# Altium schematic sheet [1] LDD-1200.SchDoc
size A3; DocumentNumber: 5; SheetNumber: 5; SheetTotal: 10
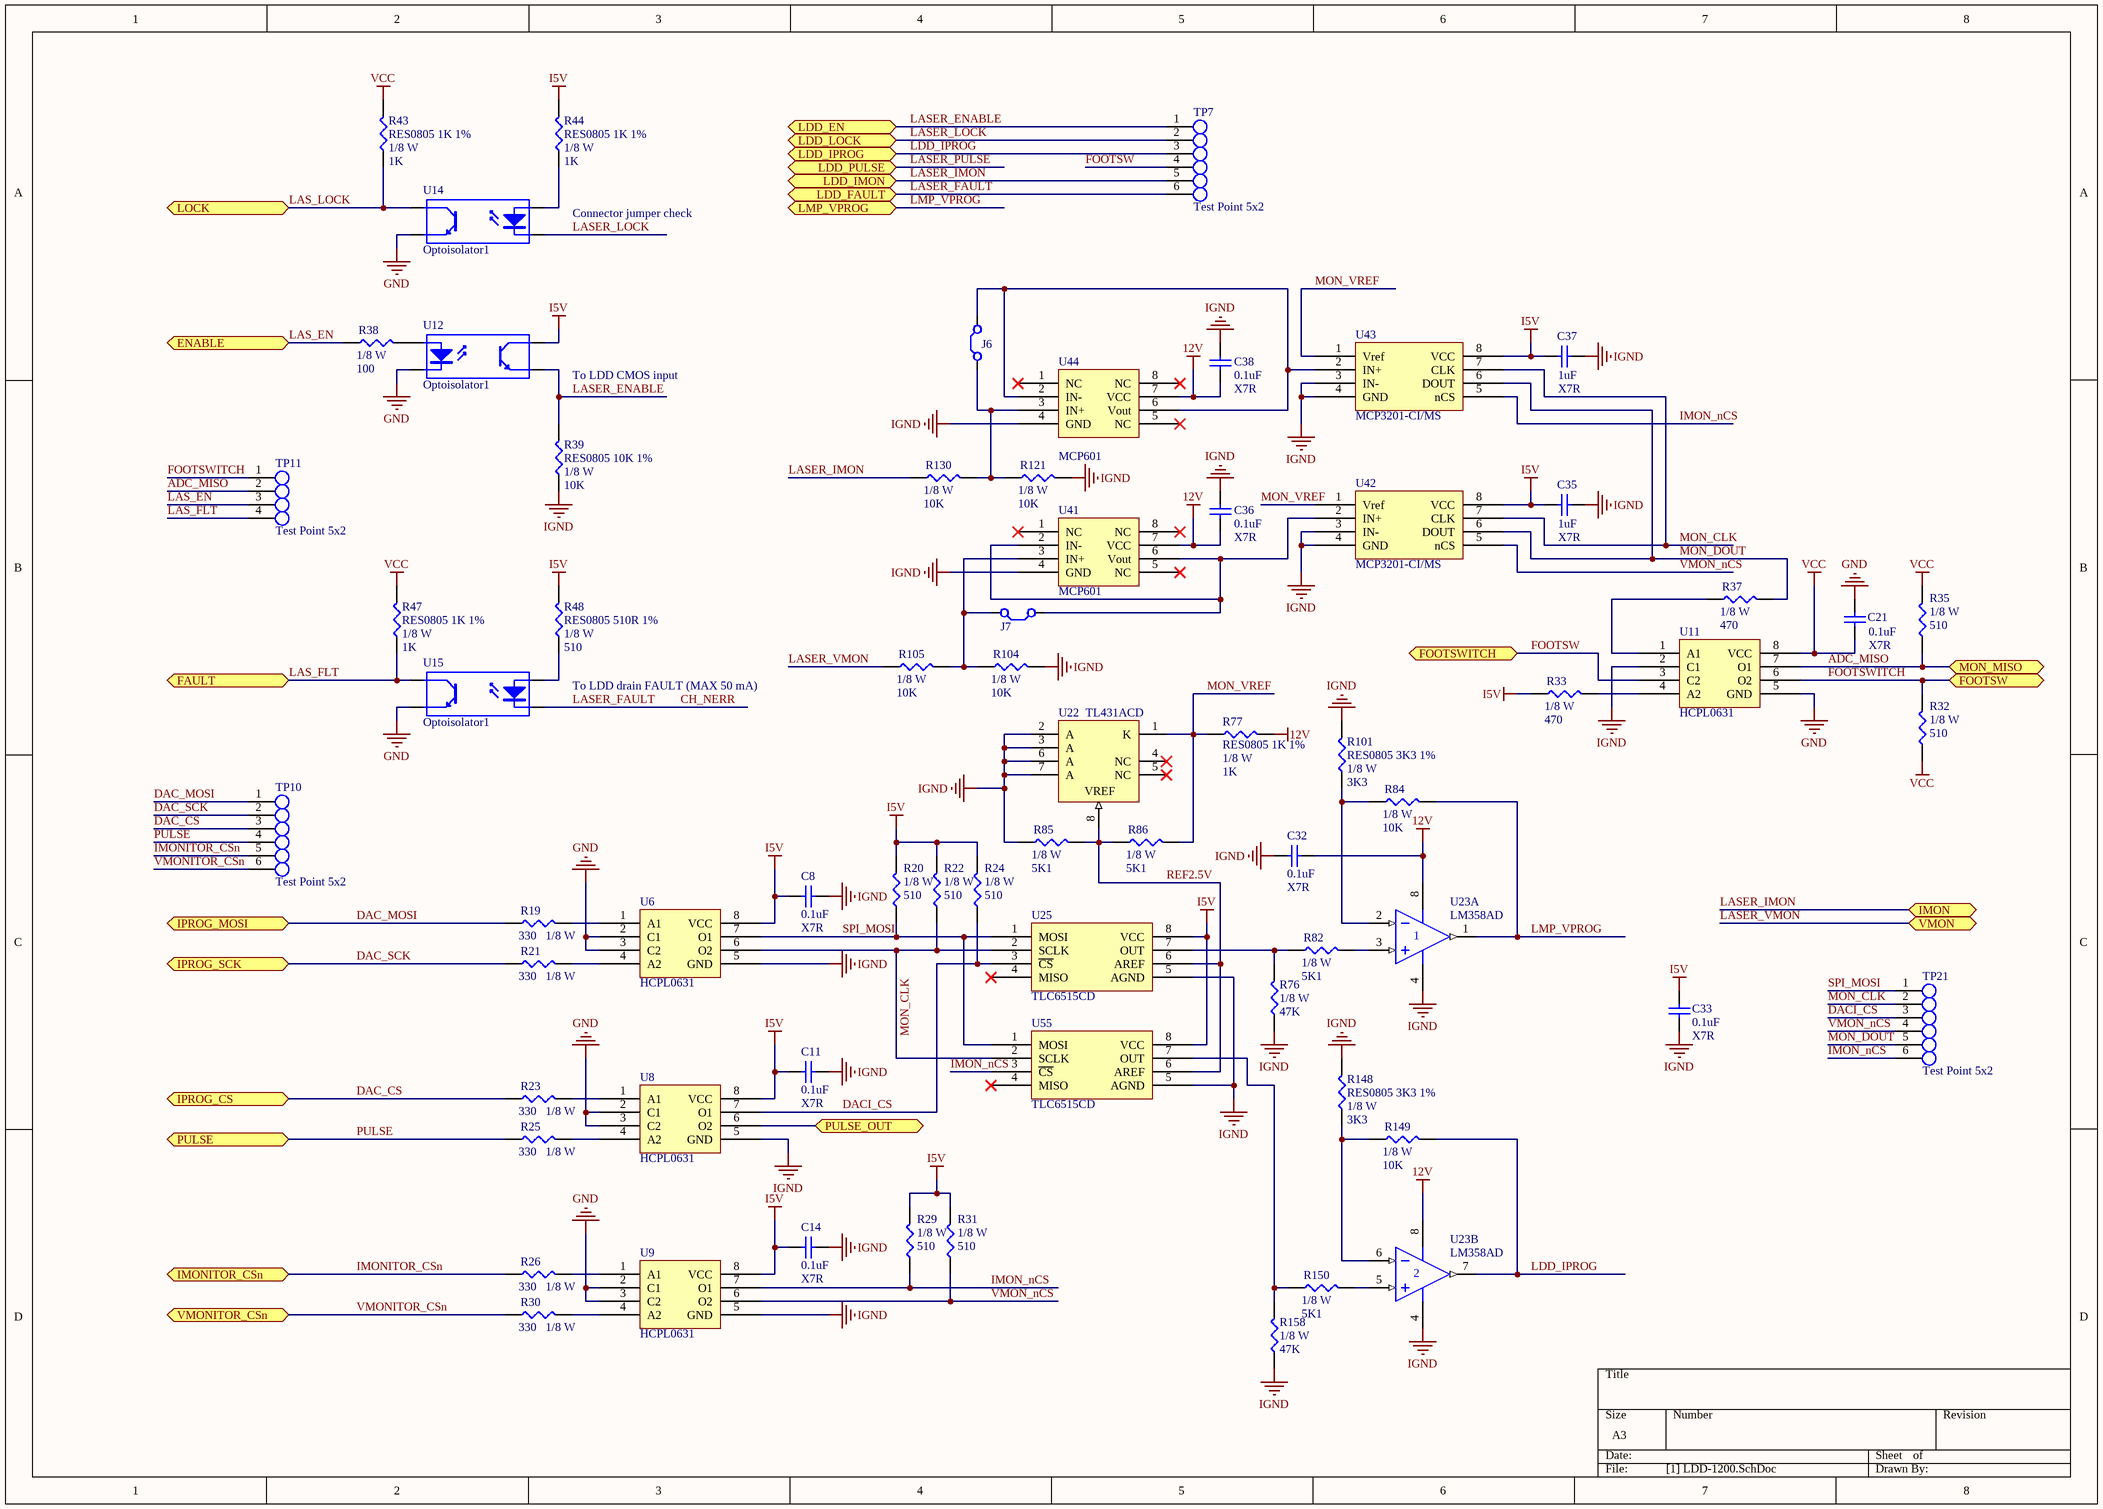
[diagram p0: [1] LDD-1200.SchDoc]

## Parts
C8  value 0.1uF  Type: X7R  [CAP0805]  (hidden comment: CAP0805 0.1uF X7R)
C11  value 0.1uF  Type: X7R  [CAP0805]  (hidden comment: CAP0805 0.1uF X7R)
C14  value 0.1uF  Type: X7R  [CAP0805]  (hidden comment: CAP0805 0.1uF X7R)
C21  value 0.1uF  Type: X7R  [CAP0805]  (hidden comment: CAP0805 0.1uF X7R)
C32  value 0.1uF  Type: X7R  [CAP0805]  (hidden comment: CAP0805 0.1uF X7R)
C33  value 0.1uF  Type: X7R  [CAP0805]  (hidden comment: CAP0805 0.1uF X7R)
C35  value 1uF  Type: X7R  [CAP0805]  (hidden comment: CAP0805 1uF X7R)
C36  value 0.1uF  Type: X7R  [CAP0805]  (hidden comment: CAP0805 0.1uF X7R)
C37  value 1uF  Type: X7R  [CAP0805]  (hidden comment: CAP0805 1uF X7R)
C38  value 0.1uF  Type: X7R  [CAP0805]  (hidden comment: CAP0805 0.1uF X7R)
J6  Jumper  (value not drawn)  (net tie, no BOM)
J7  Jumper  (value not drawn)  (net tie, no BOM)
R19  value 330  Rating: 1/8 W  [RES0805]  (hidden comment: RES0805 330R 1%)
R20  value 510  Rating: 1/8 W  [RES0805]  (hidden comment: RES0805 510R 1%)
R21  value 330  Rating: 1/8 W  [RES0805]  (hidden comment: RES0805 330R 1%)
R22  value 510  Rating: 1/8 W  [RES0805]  (hidden comment: RES0805 510R 1%)
R23  value 330  Rating: 1/8 W  [RES0805]  (hidden comment: RES0805 330R 1%)
R24  value 510  Rating: 1/8 W  [RES0805]  (hidden comment: RES0805 510R 1%)
R25  value 330  Rating: 1/8 W  [RES0805]  (hidden comment: RES0805 330R 1%)
R26  value 330  Rating: 1/8 W  [RES0805]  (hidden comment: RES0805 330R 1%)
R29  value 510  Rating: 1/8 W  [RES0805]  (hidden comment: RES0805 510R 1%)
R30  value 330  Rating: 1/8 W  [RES0805]  (hidden comment: RES0805 330R 1%)
R31  value 510  Rating: 1/8 W  [RES0805]  (hidden comment: RES0805 510R 1%)
R32  value 510  Rating: 1/8 W  [RES0805]  (hidden comment: RES0805 510R 1%)
R33  value 470  Rating: 1/8 W  [RES0805]  (hidden comment: RES0805 470R 1%)
R35  value 510  Rating: 1/8 W  [RES0805]  (hidden comment: RES0805 510R 1%)
R37  value 470  Rating: 1/8 W  [RES0805]  (hidden comment: RES0805 470R 1%)
R38  value 100  Rating: 1/8 W  [RES0805]  (hidden comment: RES0805 100R 1%)
R39  RES0805 10K 1%  value 10K  Rating: 1/8 W  [RES0805]
R43  RES0805 1K 1%  value 1K  Rating: 1/8 W  [RES0805]
R44  RES0805 1K 1%  value 1K  Rating: 1/8 W  [RES0805]
R47  RES0805 1K 1%  value 1K  Rating: 1/8 W  [RES0805]
R48  RES0805 510R 1%  value 510  Rating: 1/8 W  [RES0805]
R76  value 47K  Rating: 1/8 W  [RES0805]  (hidden comment: RES0805 47K 1%)
R77  RES0805 1K 1%  value 1K  Rating: 1/8 W  [RES0805]
R82  value 5K1  Rating: 1/8 W  [RES0805]  (hidden comment: RES0805 5K1 1%)
R84  value 10K  Rating: 1/8 W  [RES0805]  (hidden comment: RES0805 10K 1%)
R85  value 5K1  Rating: 1/8 W  [RES0805]  (hidden comment: RES0805 5K1 1%)
R86  value 5K1  Rating: 1/8 W  [RES0805]  (hidden comment: RES0805 5K1 1%)
R101  RES0805 3K3 1%  value 3K3  Rating: 1/8 W  [RES0805]
R104  value 10K  Rating: 1/8 W  [RES0805]  (hidden comment: RES0805 10K 1%)
R105  value 10K  Rating: 1/8 W  [RES0805]  (hidden comment: RES0805 10K 1%)
R121  value 10K  Rating: 1/8 W  [RES0805]  (hidden comment: RES0805 10K 1%)
R130  value 10K  Rating: 1/8 W  [RES0805]  (hidden comment: RES0805 10K 1%)
R148  RES0805 3K3 1%  value 3K3  Rating: 1/8 W  [RES0805]
R149  value 10K  Rating: 1/8 W  [RES0805]  (hidden comment: RES0805 10K 1%)
R150  value 5K1  Rating: 1/8 W  [RES0805]  (hidden comment: RES0805 5K1 1%)
R158  value 47K  Rating: 1/8 W  [RES0805]  (hidden comment: RES0805 47K 1%)
TP7  Test Point 5x2  [PG-1.5-13.5-6P-2.54PH]
TP10  Test Point 5x2  [PG-1.5-13.5-6P-2.54PH]
TP11  Test Point 5x2  [PG-1.5-13.5-4P-2.54PH]
TP21  Test Point 5x2  [PG-1.5-13.5-6P-2.54PH]
U6  HCPL0631  [SOIC8]
U8  HCPL0631  [SOIC8]
U9  HCPL0631  [SOIC8]
U11  HCPL0631  [SOIC8]
U12  Optoisolator1  [DIP-4]
U14  Optoisolator1  [DIP-4]
U15  Optoisolator1  [DIP-4]
U22  TL431ACD  [SOIC8]
U23  LM358AD  [SOIC8]  (parts A,B of 2)
U25  TLC6515CD  [SOIC8]
U41  MCP601  [SOIC8]
U42  MCP3201-CI/MS  [MSOP8]
U43  MCP3201-CI/MS  [MSOP8]
U44  MCP601  [SOIC8]
U55  TLC6515CD  [SOIC8]

## Ports
ENABLE, FAULT, FOOTSW, FOOTSWITCH, IMON, IMONITOR_CSn, IPROG_CS, IPROG_MOSI, IPROG_SCK, LDD_EN, LDD_FAULT, LDD_IMON, LDD_IPROG, LDD_LOCK, LDD_PULSE, LMP_VPROG, LOCK, MON_MISO, PULSE, PULSE_OUT, VMON, VMONITOR_CSn

## Nets
12V: C32.2 C36.1 C38.1 R77.2 U23.8(V+) U41.7(VCC) U44.7(VCC)
GND: C21.2 U6.2(C1) U6.3(C2) U8.2(C1) U8.3(C2) U9.2(C1) U9.3(C2) U11.5(GND) U12.2(K) U14.3(E) U15.3(E)
I5V: C8.1 C11.1 C14.1 C33.1 C35.1 C37.1 R20.2 R22.2 R24.2 R29.2 R31.2 R33.1 R44.2 R48.2 U6.8(VCC) U8.8(VCC) U9.8(VCC) U12.4(C) U25.8(VCC) U42.8(VCC) U43.8(VCC) U55.8(VCC)
IGND: C8.2 C11.2 C14.2 C32.1 C33.2 C35.2 C36.2 C37.2 C38.2 R39.1 R76.1 R85.1 R101.2 R104.2 R121.2 R148.2 R158.1 U6.5(GND) U8.5(GND) U9.5(GND) U11.2(C1) U22.2(A) U22.3(A) U22.6(A) U22.7(A) U23.4(V-) U25.5(AGND) U41.4(GND) U42.3(IN-) U42.4(GND) U43.3(IN-) U43.4(GND) U44.4(GND) U55.5(AGND)
VCC: C21.1 R32.1 R35.2 R43.2 R47.2 U11.8(VCC)
ADC_MISO: R35.1 TP11.2 U11.7(O1) ; port MON_MISO
CH_NERR: TP7.6 U15.2(K) ; port LDD_FAULT  [also labelled LASER_FAULT]
DAC_CS: R23.1 TP10.3 ; port IPROG_CS
DAC_MOSI: R19.1 TP10.1 ; port IPROG_MOSI
DAC_SCK: R21.1 TP10.2 ; port IPROG_SCK
DACI_CS: R24.1 TP21.3 U8.7(O1) U25.3(~{CS})
FOOTSW: TP7.4 U11.3(C2) ; port FOOTSWITCH
FOOTSWITCH: R32.2 TP11.1 U11.6(O2) ; port FOOTSW
IMON_nCS: R29.1 TP21.6 U9.7(O1) U43.5(nCS) U55.3(~{CS})
IMONITOR_CSn: R26.1 TP10.5 ; port IMONITOR_CSn
LAS_EN: R38.1 TP11.3 ; port ENABLE
LAS_FLT: R47.1 TP11.4 U15.4(C) ; port FAULT
LAS_LOCK: R43.1 U14.4(C) ; port LOCK
LASER_ENABLE: R39.2 TP7.1 U12.3(E) ; port LDD_EN
LASER_IMON: R130.1 TP7.5 ; port LDD_IMON, port IMON
LASER_LOCK: TP7.2 U14.2(K) ; port LDD_LOCK
LASER_PULSE: port LDD_PULSE
LASER_VMON: R105.1 ; port VMON
LDD_IPROG: R149.2 TP7.3 U23.7(OUT) ; port LDD_IPROG
LMP_VPROG: R84.2 U23.1(OUT) ; port LMP_VPROG
MON_CLK: R22.1 TP21.2 U6.6(O2) U25.2(SCLK) U42.7(CLK) U43.7(CLK) U55.2(SCLK)
MON_DOUT: R37.2 TP21.5 U42.6(DOUT) U43.6(DOUT)
MON_VREF: R77.1 R86.2 U22.1(K) U42.1(Vref) U43.1(Vref)
PULSE: R25.1 TP10.4 ; port PULSE
PULSE_OUT: U8.6(O2) ; port PULSE_OUT
REF2.5V: R85.2 R86.1 U22.8(VREF) U25.6(AREF) U55.6(AREF)
SPI_MOSI: R20.1 TP21.1 U6.7(O1) U25.1(MOSI) U55.1(MOSI)
VMON_nCS: R31.1 TP21.4 U9.6(O2) U42.5(nCS)
VMONITOR_CSn: R30.1 TP10.6 ; port VMONITOR_CSn
NetJ6_0: J6.0 R121.1 R130.2 U44.3(IN+)
NetJ6_1: J6.1 U43.2(IN+) U44.2(IN-) U44.6(Vout)
NetJ7_0: J7.0 U41.2(IN-) U41.6(Vout) U42.2(IN+)
NetJ7_1: J7.1 R104.1 R105.2 U41.3(IN+)
NetR19_2: R19.2 U6.1(A1)
NetR21_2: R21.2 U6.4(A2)
NetR23_2: R23.2 U8.1(A1)
NetR25_2: R25.2 U8.4(A2)
NetR26_2: R26.2 U9.1(A1)
NetR30_2: R30.2 U9.4(A2)
NetR33_2: R33.2 U11.4(A2)
NetR37_1: R37.1 U11.1(A1)
NetR38_2: R38.2 U12.1(A)
NetR44_1: R44.1 U14.1(A)
NetR48_1: R48.1 U15.1(A)
NetR76_2: R76.2 R82.1 U25.7(OUT)
NetR82_2: R82.2 U23.3(IN+)
NetR84_1: R84.1 R101.1 U23.2(IN-)
NetR148_1: R148.1 R149.1 U23.6(IN-)
NetR150_1: R150.1 R158.2 U55.7(OUT)
NetR150_2: R150.2 U23.5(IN+)

Not connected (* = marked no-connect by the designer): U22 4(NC)* 5(NC)*; U25 4(MISO)*; U41 1(NC)* 5(NC)* 8(NC)*; U44 1(NC)* 5(NC)* 8(NC)*; U55 4(MISO)*

## Notes on the sheet
- Connector jumper check
- To LDD CMOS input
- To LDD drain FAULT (MAX 50 mA)

## Library data of the parts
C8 C11 C14 C21 C32 C33 C36 C38 = CAP0805 0.1uF X7R: Surface-mount ceramic multilayer capacitor; Manufacturer: YAGEO; Manufacturer Part Number: CC0805JRX7R9BB104; Voltage: 50V; Tolerance: 5%; ComponentLink1Description: Datasheet; ComponentLink1URL: http://www.deaha.com/pdf/YAGEO-CC_series.pdf
C35 C37 = CAP0805 1uF X7R: Surface-mount ceramic multilayer capacitor; Manufacturer: YAGEO; Manufacturer Part Number: CC0805KKX7R7BB105; Voltage: 16V; Tolerance: 5%; ComponentLink1Description: Datasheet; ComponentLink1URL: http://www.deaha.com/pdf/YAGEO-CC_series.pdf
R19 R21 R23 R25 R26 R30 = RES0805 330R 1%: Think Film Chip resistor; Manufacturer Part Number: RC0805FR-07330RL; Temperature Coefficient: 100ppm/K; Tolerance: 1%; Type: ThickFilm
R20 R22 R24 R29 R31 R32 R35 R48 = RES0805 510R 1%: Think Film Chip resistor; Manufacturer Part Number: RC0805FR-07510RL; Temperature Coefficient: 100ppm/K; Tolerance: 1%; Type: ThickFilm
R33 R37 = RES0805 470R 1%: Think Film Chip resistor; Manufacturer Part Number: RC0805JR-07470RL; Temperature Coefficient: 100ppm/K; Tolerance: 1%; Type: ThickFilm
R38 = RES0805 100R 1%: Think Film Chip resistor; Manufacturer Part Number: RC0805FR-07100RL; Temperature Coefficient: 100ppm/K; Tolerance: 1%; Type: ThickFilm
R39 R84 R104 R105 R121 R130 R149 = RES0805 10K 1%: Think Film Chip resistor; Manufacturer Part Number: RC0805FR-0710KL; Temperature Coefficient: 100ppm/K; Tolerance: 1%; Type: ThickFilm
R43 R44 R47 R77 = RES0805 1K 1%: Think Film Chip resistor; Manufacturer Part Number: RC0805FR-071KL; Temperature Coefficient: 100ppm/K; Tolerance: 1%; Type: ThickFilm
R76 R158 = RES0805 47K 1%: Think Film Chip resistor; Manufacturer Part Number: RC0805JR-0747KL; Temperature Coefficient: 100ppm/K; Tolerance: 1%; Type: ThickFilm
R82 R85 R86 R150 = RES0805 5K1 1%: Think Film Chip resistor; Manufacturer Part Number: RC0805FR-075K1L; Temperature Coefficient: 100ppm/K; Tolerance: 1%; Type: ThickFilm
R101 R148 = RES0805 3K3 1%: Think Film Chip resistor; Manufacturer Part Number: RC0805FR-073K3L; Temperature Coefficient: 100ppm/K; Tolerance: 1%; Type: ThickFilm
TP7 TP10 TP21 = PG-1.5-13.5-6P-2.54PH
TP11 = PG-1.5-13.5-4P-2.54PH
U6 U8 U9 U11 = HCPL0631: 2-channel opto-coupler
U12 U14 U15 = Optoisolator1: 4-Pin Phototransistor Optocoupler; Published: 24-Mar-1999; LatestRevisionDate: 04-Mar-2005; LatestRevisionNote: Sch pins 3 & 4 Swapped.; DatasheetVersion: Nov-2003; PackageReference: DIP-4; Publisher: Altium Limited
U22 = TL431ACD: Adjustable Precision Shunt Regulator; Published: 15-Apr-2002; LatestRevisionDate: 13-Apr-2006; LatestRevisionNote: IPC-7351 Footprint Added.; DatasheetVersion: Oct-2000; PackageVersion: Jan-1998; PackageReference: D008; Publisher: Altium Limited; PackageDescription: 8-Pin Small Outline Integrated Circuit 1.27 mm Pitch; Code_IPC: SOIC127P600-8; ComponentLink1Description: Manufacturer Link; ComponentLink1URL: http://www.ti.com/; ComponentLink2Description: Datasheet; ComponentLink2URL: http://www-s.ti.com/sc/ds/tl431a.pdf
U23 = LM358AD: Dual Operational Amplifier; Published: 15-Apr-2002; LatestRevisionDate: 13-Apr-2006; LatestRevisionNote: IPC-7351 Footprint Added.; DatasheetVersion: Aug-1988; PackageVersion: Jan-1998; PackageReference: D008; Publisher: Altium Limited; PackageDescription: 8-Pin Small Outline Integrated Circuit 1.27 mm Pitch; Code_IPC: SOIC127P600-8; ComponentLink1Description: Manufacturer Link; ComponentLink1URL: http://www.ti.com/; ComponentLink2Description: Datasheet; ComponentLink2URL: http://www-s.ti.com/sc/ds/lm358.pdf
U25 U55 = TLC6515: 10-bit analog to digiyal converter; Manufacturer: Texas Instruments
U41 U44 = MCP601: Operational Amplifier
U42 U43 = MCP3201-CI/MS: SAR 12-bit Analog-to-Digital  (A/D); Manufacturer: Microchip; Maximum Sampling Rate: 100 ksps; Supplier 1: Platan; Supplier 2: Terraelectronica; ComponentLink1Description: Datasheet; ComponentLink1URL: http://www.farnell.com/datasheets/1669366.pdf; Supplier Part Number 1: 200659200; Supplier Part Number 2: 181061